# EAGLE design dronemonster (EAGLE 7.7.0)
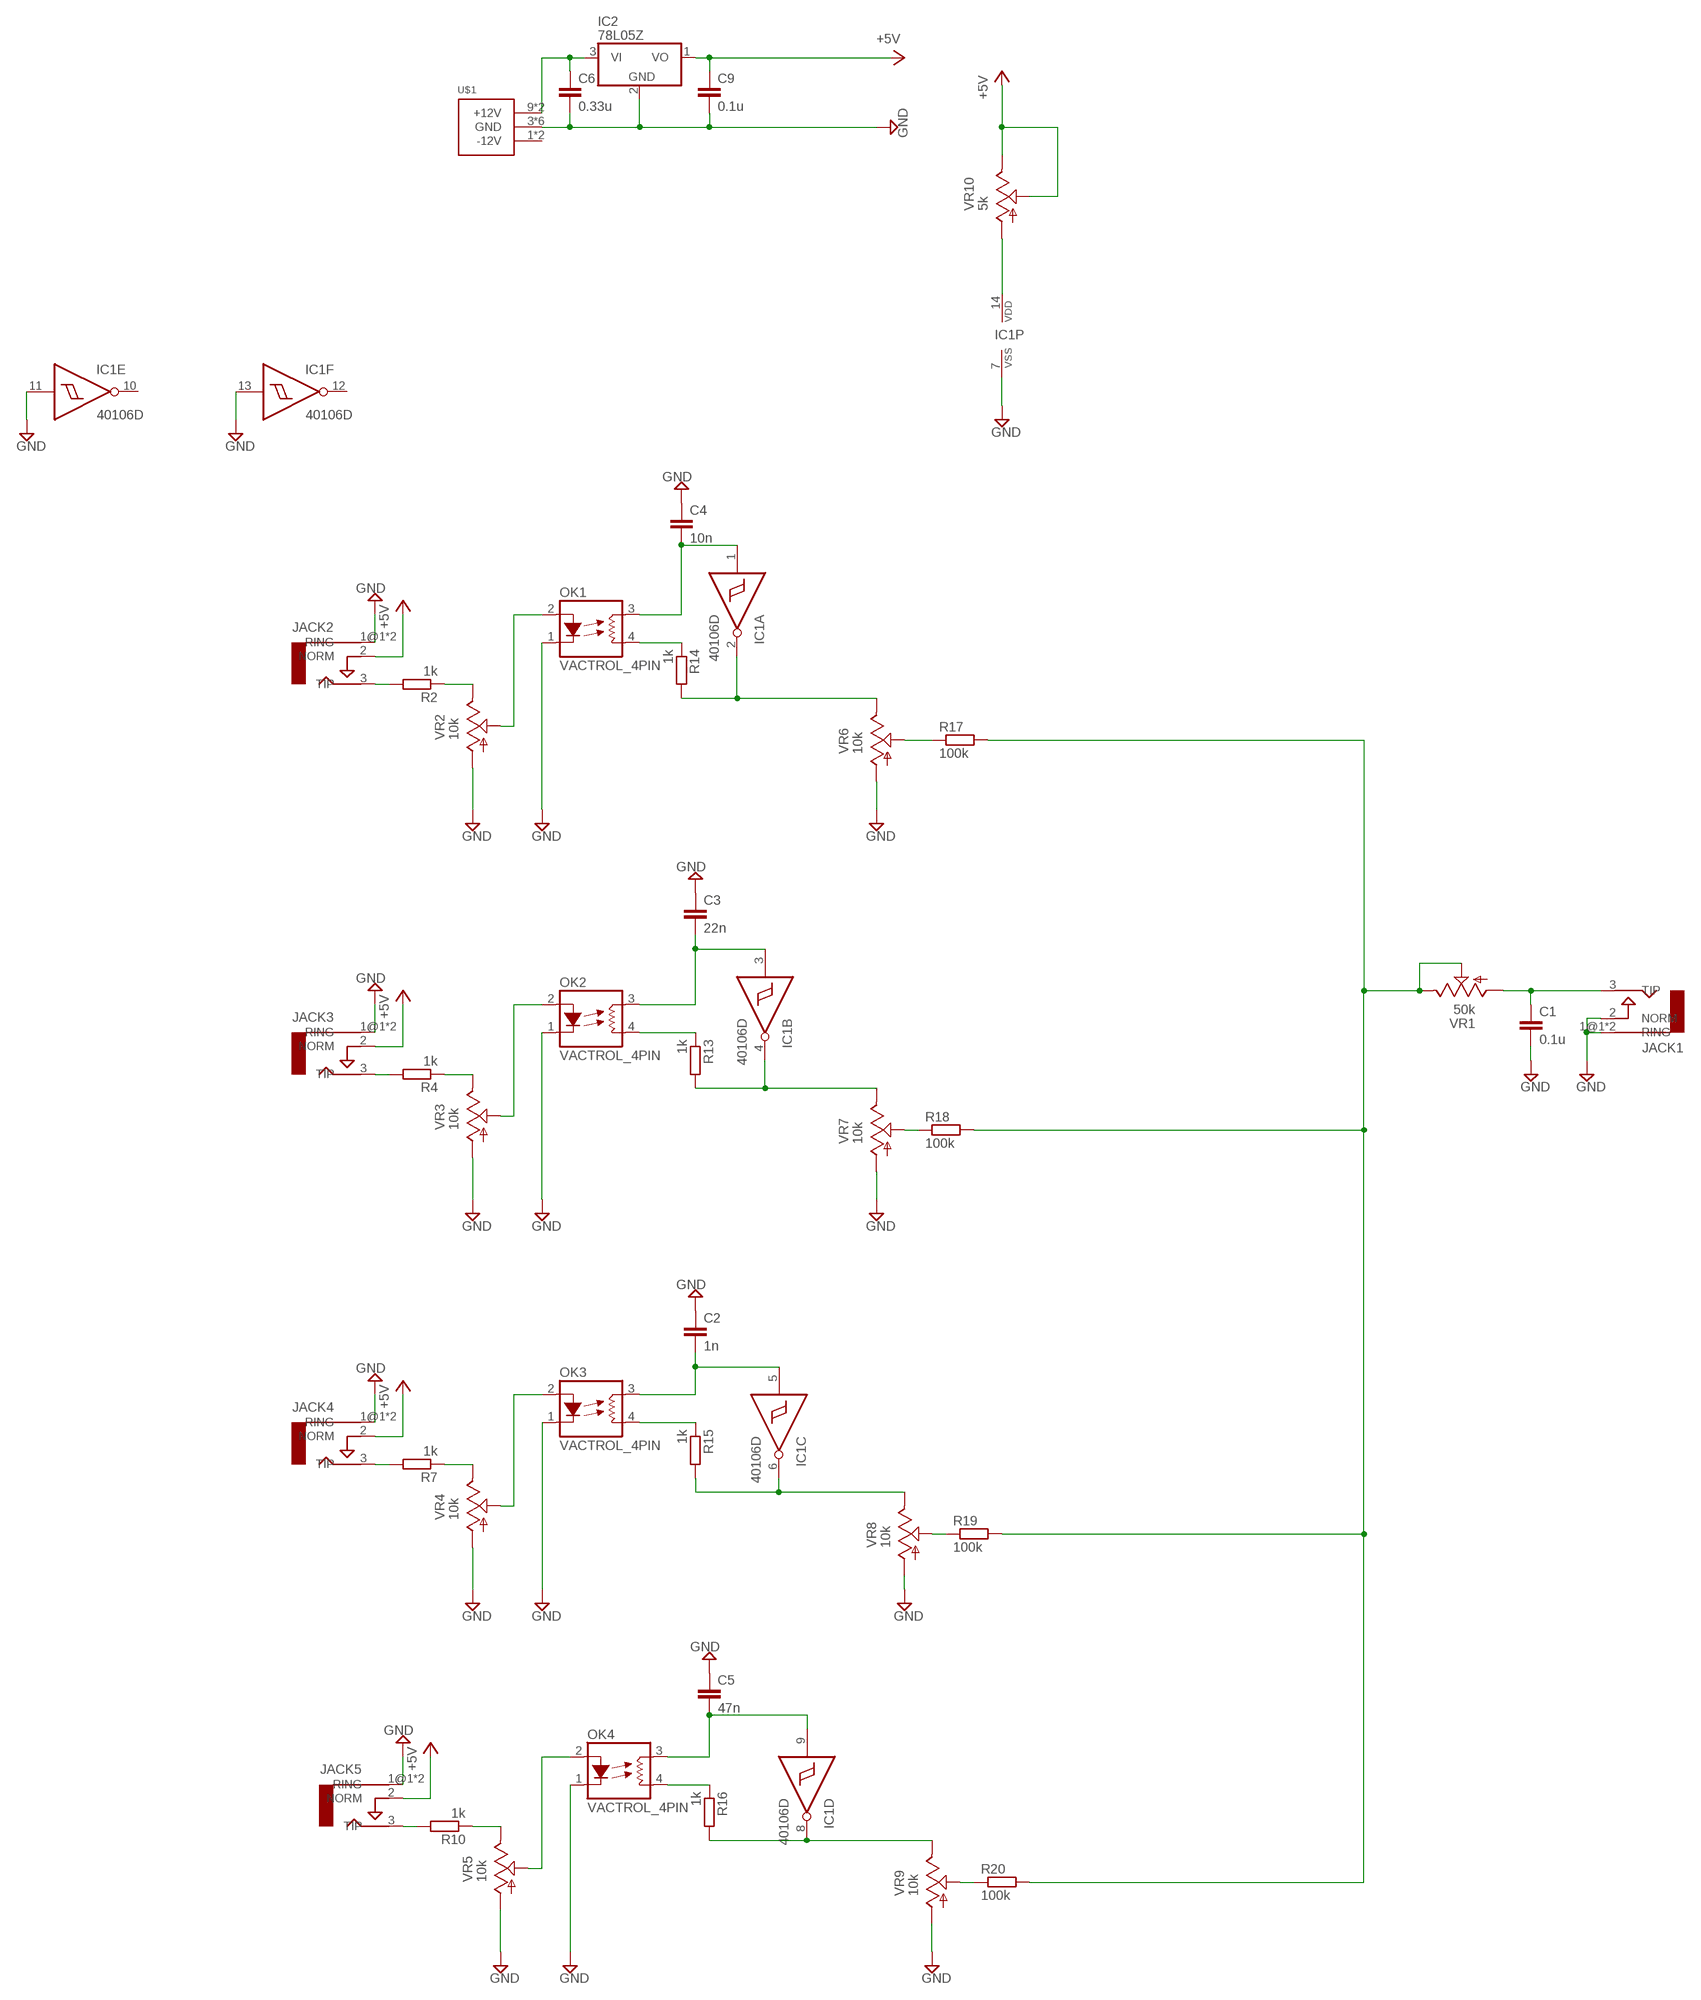
[diagram p0: schematic, sheet 1]

## Parts
C1  0.1u  C-EU050-025X075  [C050-025X075]
C2  1n  C-EU050-025X075  [C050-025X075]
C3  22n  C-EU050-025X075  [C050-025X075]
C4  10n  C-EU050-025X075  [C050-025X075]
C5  47n  C-EU050-025X075  [C050-025X075]
C6  0.33u  C-EUC0805  [C0805]
C9  0.1u  C-EUC0805  [C0805]
IC1  40106D  [SO14]
IC2  78L05Z  [TO92]
JACK1  AUDIO-JACKERTHENVAR  [ERTHENVAR-JACK]
JACK2  AUDIO-JACKERTHENVAR  [ERTHENVAR-JACK]
JACK3  AUDIO-JACKERTHENVAR  [ERTHENVAR-JACK]
JACK4  AUDIO-JACKERTHENVAR  [ERTHENVAR-JACK]
JACK5  AUDIO-JACKERTHENVAR  [ERTHENVAR-JACK]
OK1  VACTROL_4PIN  [VACTROL_4PIN_VTL5C]
OK2  VACTROL_4PIN  [VACTROL_4PIN_VTL5C]
OK3  VACTROL_4PIN  [VACTROL_4PIN_VTL5C]
OK4  VACTROL_4PIN  [VACTROL_4PIN_VTL5C]
R2  1k  R-EU_R0805  [R0805]
R4  1k  R-EU_R0805  [R0805]
R7  1k  R-EU_R0805  [R0805]
R10  1k  R-EU_R0805  [R0805]
R13  1k  R-EU_R0805  [R0805]
R14  1k  R-EU_R0805  [R0805]
R15  1k  R-EU_R0805  [R0805]
R16  1k  R-EU_R0805  [R0805]
R17  100k  R-EU_R0805  [R0805]
R18  100k  R-EU_R0805  [R0805]
R19  100k  R-EU_R0805  [R0805]
R20  100k  R-EU_R0805  [R0805]
U$1  POWER_SIMPLE10  [POWER_10]
VR1  50k  9MM_SNAP-IN_POT_  [9MM_SNAP-IN_POT]
VR2  10k  9MM_SNAP-IN_POT_  [9MM_SNAP-IN_POT]
VR3  10k  9MM_SNAP-IN_POT_  [9MM_SNAP-IN_POT]
VR4  10k  9MM_SNAP-IN_POT_  [9MM_SNAP-IN_POT]
VR5  10k  9MM_SNAP-IN_POT_  [9MM_SNAP-IN_POT]
VR6  10k  9MM_SNAP-IN_POT_  [9MM_SNAP-IN_POT]
VR7  10k  9MM_SNAP-IN_POT_  [9MM_SNAP-IN_POT]
VR8  10k  9MM_SNAP-IN_POT_  [9MM_SNAP-IN_POT]
VR9  10k  9MM_SNAP-IN_POT_  [9MM_SNAP-IN_POT]
VR10  5k  9MM_SNAP-IN_POT_  [9MM_SNAP-IN_POT]

## Nets
+5V: C9.1 IC2.1(VO) JACK2.2(NORM) JACK3.2(NORM) JACK4.2(NORM) JACK5.2(NORM) VR10.2(S) VR10.3(E)
GND: C1.2 C2.1 C3.1 C4.1 C5.1 C6.2 C9.2 IC1.7(P:VSS) IC1.11(E:I) IC1.13(F:I) IC2.2(GND) JACK1.1@1(RING) JACK1.1@2(RING) JACK1.2(NORM) JACK2.1@1(RING) JACK2.1@2(RING) JACK3.1@1(RING) JACK3.1@2(RING) JACK4.1@1(RING) JACK4.1@2(RING) JACK5.1@1(RING) JACK5.1@2(RING) OK1.1(LED-) OK2.1(LED-) OK3.1(LED-) OK4.1(LED-) U$1.3(GND) U$1.4(GND) U$1.5(GND) U$1.6(GND) U$1.7(GND) U$1.8(GND) VR2.1(A) VR3.1(A) VR4.1(A) VR5.1(A) VR6.1(A) VR7.1(A) VR8.1(A) VR9.1(A)
N$1: C1.1 JACK1.3(TIP) VR1.1(A)
N$2: IC1.14(P:VDD) VR10.1(A)
N$3: JACK2.3(TIP) R2.2
N$4: OK1.2(LED+) VR2.2(S)
N$6: R2.1 VR2.3(E)
N$10: R4.1 VR3.3(E)
N$12: JACK3.3(TIP) R4.2
N$14: OK2.2(LED+) VR3.2(S)
N$16: R7.1 VR4.3(E)
N$18: JACK4.3(TIP) R7.2
N$20: OK3.2(LED+) VR4.2(S)
N$22: R10.1 VR5.3(E)
N$24: JACK5.3(TIP) R10.2
N$26: OK4.2(LED+) VR5.2(S)
N$27: R20.1 VR9.2(S)
N$28: R19.1 VR8.2(S)
N$29: OK4.4(RES2) R16.1
N$30: IC1.8(D:O) R16.2 VR9.3(E)
N$31: C5.2 IC1.9(D:I) OK4.3(RES1)
N$32: OK3.4(RES2) R15.1
N$33: IC1.6(C:O) R15.2 VR8.3(E)
N$34: C2.2 IC1.5(C:I) OK3.3(RES1)
N$35: OK2.4(RES2) R13.1
N$36: IC1.4(B:O) R13.2 VR7.3(E)
N$37: C3.2 IC1.3(B:I) OK2.3(RES1)
N$38: OK1.4(RES2) R14.1
N$39: IC1.2(A:O) R14.2 VR6.3(E)
N$40: C4.2 IC1.1(A:I) OK1.3(RES1)
N$41: R18.1 VR7.2(S)
N$45: C6.1 IC2.3(VI) U$1.9(+12V) U$1.10(+12V)
N$46: R17.1 VR6.2(S)
OSC4: R17.2 R18.2 R19.2 R20.2 VR1.2(S) VR1.3(E)
Unconnected: IC1.10(E:O) IC1.12(F:O) U$1.1(-12V) U$1.2(-12V)

## Library data of the parts
C1-C6 C9 = rcl:C-EU: CAPACITOR, European symbol
IC1 = 40xx:40106: Hex SCHMITT TRIGGER
IC2 = linear:78*: Positive VOLTAGE REGULATOR Source: http://cache.national.com/ds/LM/LM78L05.pdf http://www.fairchildsemi.com/ds/LM/LM7805.pdf
JACK1-JACK5 = erthenvar:AUDIO-JACK: Switching Mono 3.5mm Audio Jack from Erthenvar.
OK1-OK4 = MusicThingModular:VACTROL_4PIN: 4 Pin Vactrol Resistive Photocoupler
R2 R4 R7 R10 R13-R20 = rcl:R-EU_: RESISTOR, European symbol
U$1 = eurorack:POWER_SIMPLE
VR1-VR10 = MusicThingModular:9MM_SNAP-IN_POT: 9mm vertical snap-in pot, Alpha / Panasonic style

## Board
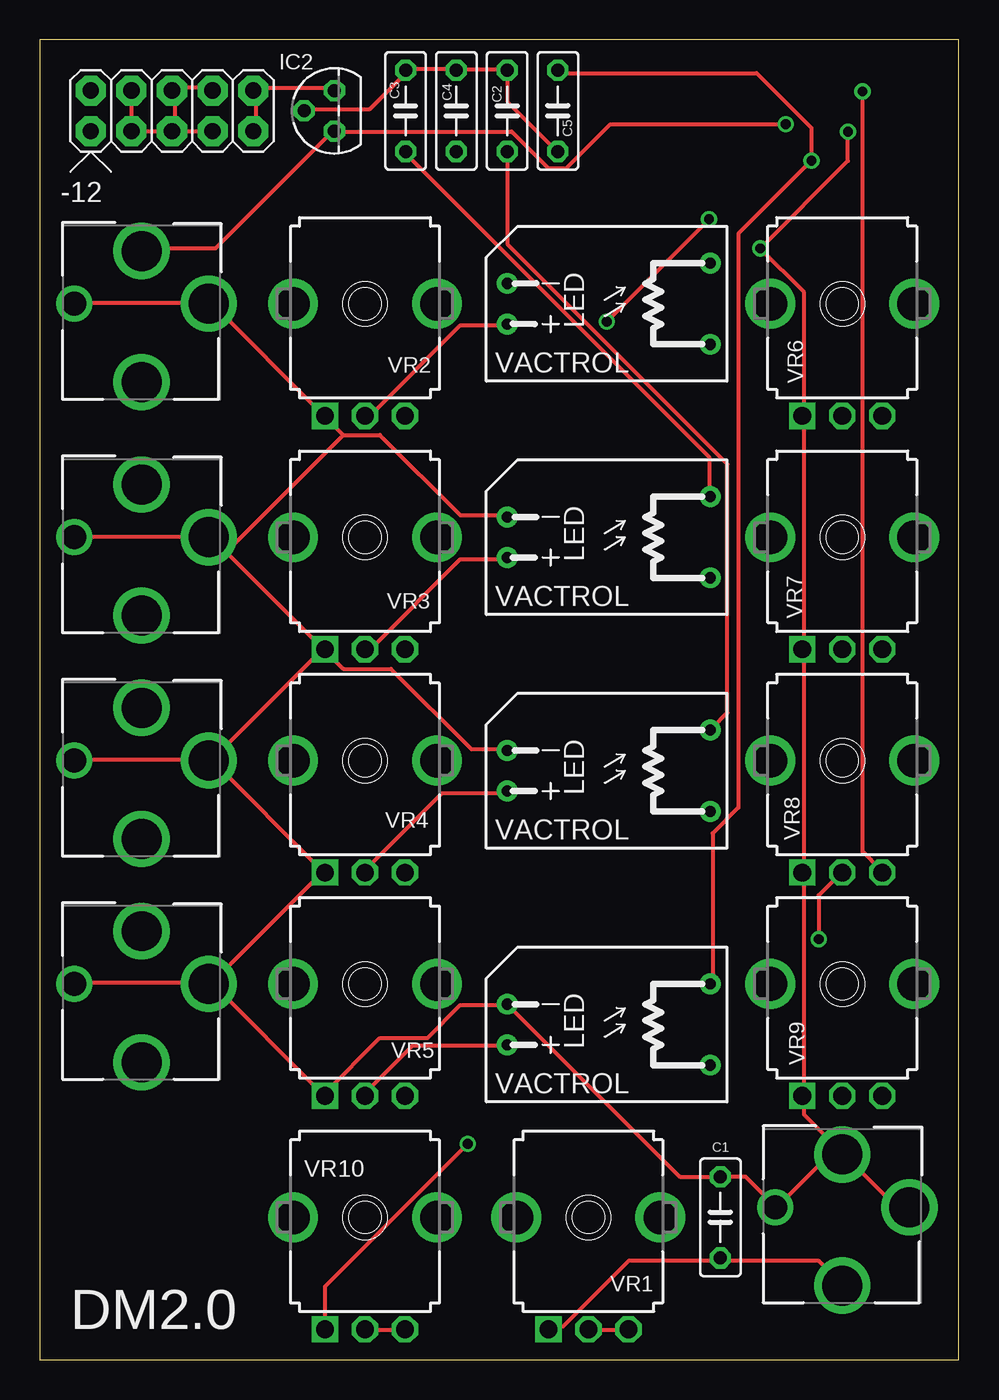
[diagram p1: board, top side]
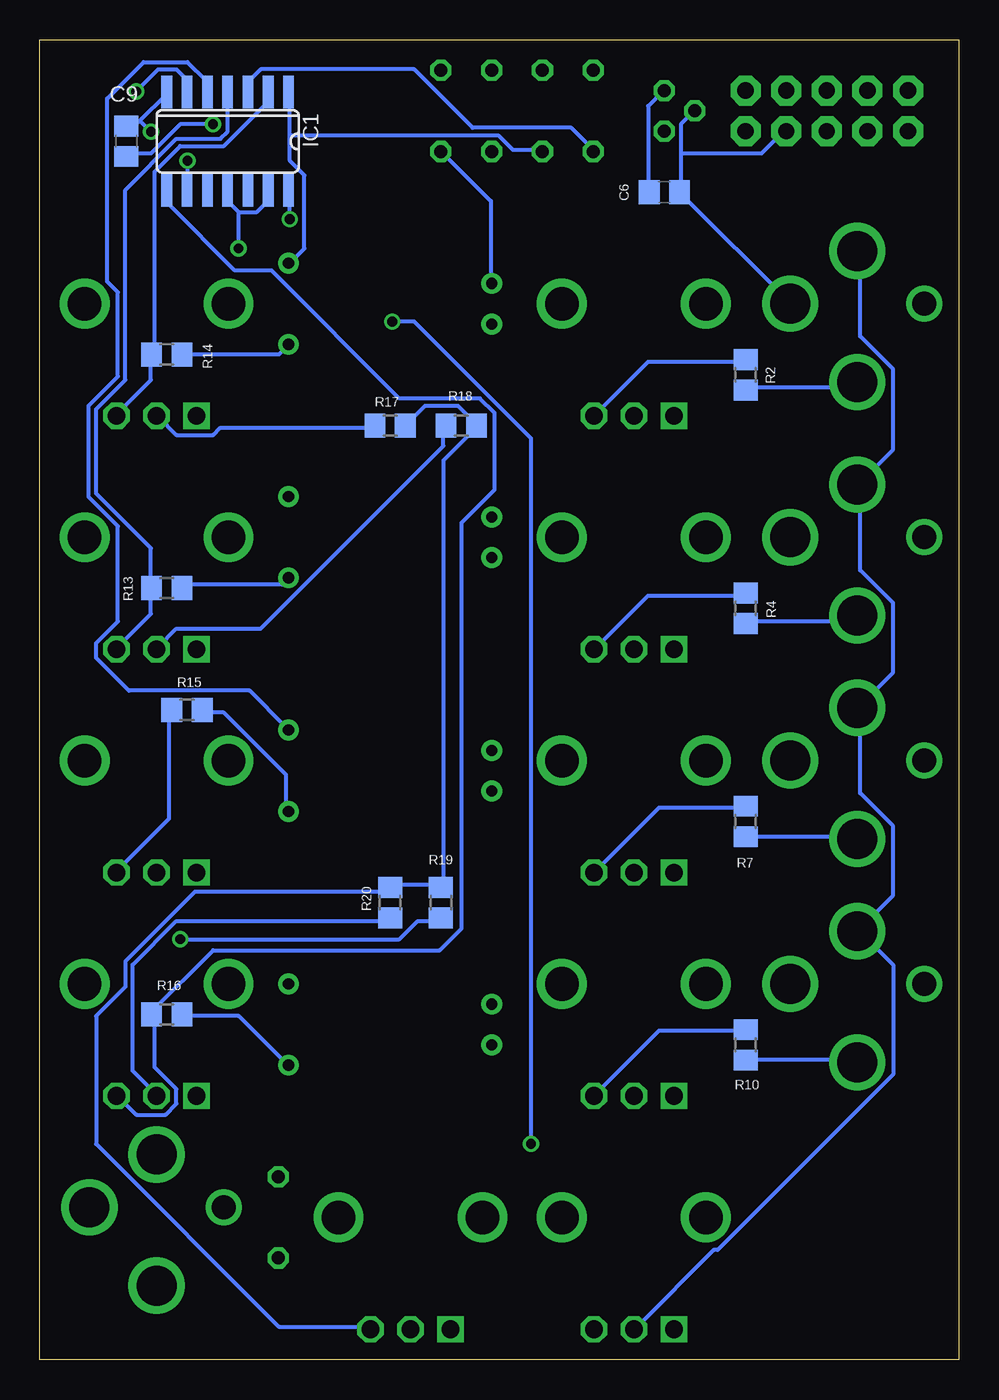
[diagram p2: board, bottom side, seen from below]

Size 57.45 x 82.54 mm. Coordinates in mm from the lower left corner, seen from the top.
Outline: 0,0 57.45,0 57.45,82.54 0,82.54 0,0
Copper layers (1*16): Top 0.035mm / dielectric 1.5mm / Bottom 0.035mm
Design rules "default": minimum track width 10mil, minimum drill 24mil, track to track 8mil, track to pad 8mil, pad to pad 8mil, via to via 8mil, smd to smd 8mil, copper to edge 40mil, drill to drill 8mil, minimum pad ring 10mil, minimum via ring 8mil, stop-mask expansion 4mil, vias tented up to drill 0mil, thermal gap 10mil

### Footprints (pad centres in the part's own frame; a part is rotated, then mirrored left to right if it is on the bottom)
C050-025X075 = drill 0.813 octagon: 1 -2.54,0; 2 2.54,0
C0805 = smd 1.3 x 1.5: 1 -0.95,0; 2 0.95,0
SO14 = smd 0.66 x 2.032: 1 -3.81,-3.073; 2 -2.54,-3.073; 3 -1.27,-3.073; 4 0,-3.073; 5 1.27,-3.073; 6 2.54,-3.073; 7 3.81,-3.073; 8 3.81,3.073; 9 2.54,3.073; 10 1.27,3.073; 11 0,3.073; 12 -1.27,3.073; 13 -2.54,3.073; 14 -3.81,3.073
TO92 = drill 0.813 octagon: 1 -1.27,0; 2 0,1.905; 3 1.27,0
ERTHENVAR-JACK = drill 2.5: 1@1 -4.2,0; 2 0,-3.3; 3 0,4.9 | drill 1.5: 1@2 4.2,0
VACTROL_4PIN_VTL5C = drill 0.7 pad 1.3: 1 -6.35,1.27; 2 -6.35,-1.27; 3 6.35,2.54; 4 6.35,-2.54
R0805 = smd 1.3 x 1.5: 1 -0.95,0; 2 0.95,0
POWER_10 = drill 1.016 pad 1.88 octagon: 1 -5.08,-1.27; 2 -5.08,1.27; 3 -2.54,-1.27; 4 -2.54,1.27; 5 0,-1.27; 6 0,1.27; 7 2.54,-1.27; 8 2.54,1.27; 9 5.08,-1.27; 10 5.08,1.27
9MM_SNAP-IN_POT = drill 1.1 square: 1 -2.5,-7 | drill 1.1 octagon: 2 0,-7; 3 2.5,-7 | drill 2.1 pad 2.794: CHASSIS1 -4.5,0; CHASSIS2 4.5,0

### Placement (x,y rotation side)
C1  42.55,8.89 90 top
C2  29.21,78.11 270 top
C3  22.86,78.11 270 top
C4  26.04,78.11 270 top
C5  32.38,78.11 90 top
C6  18.41,73.03 0 bottom
C9  52.07,76.2 90 bottom
IC1  45.72,76.2 180 bottom
IC2  18.41,78.11 90 top
JACK1  50.16,9.53 180 top
JACK2  6.35,66.04 180 top
JACK3  6.35,51.44 180 top
JACK4  6.35,37.47 180 top
JACK5  6.35,23.5 180 top
OK1  35.56,66.04 0 top
OK2  35.56,51.44 0 top
OK3  35.56,36.83 0 top
OK4  35.56,20.95 0 top
R2  13.34,61.59 270 bottom
R4  13.34,46.99 270 bottom
R7  13.34,33.66 270 bottom
R10  13.34,19.68 270 bottom
R13  49.53,48.26 180 bottom
R14  49.53,62.87 180 bottom
R15  48.26,40.64 180 bottom
R16  49.53,21.59 180 bottom
R17  35.56,58.42 0 bottom
R18  31.11,58.42 0 bottom
R19  32.38,28.57 90 bottom
R20  35.56,28.57 90 bottom
U$1  8.26,78.11 0 top
VR1  34.29,8.89 0 top
VR2  20.32,66.04 0 top
VR3  20.32,51.44 0 top
VR4  20.32,37.47 0 top
VR5  20.32,23.5 0 top
VR6  50.16,66.04 0 top
VR7  50.16,51.44 0 top
VR8  50.16,37.47 0 top
VR9  50.16,23.5 0 top
VR10  20.32,8.89 0 top

### Tracks (layer width: path | path; a pad name or v marks a point on that pad's centre or on a via)
+5V  (via drill 0.61)
  Top 0.254: v46.63,77.27 35.66,77.27 32.92,74.52 31.77,74.52 29.49,76.81 18.52,76.81 IC2.1 18.29,76.81 10.97,69.49 6.4,69.49 JACK2.2 | VR10.2 20.34,1.83 22.63,1.83 VR10.3
  Bottom 0.254: v46.63,77.27 48.69,77.27 50.52,75.44 51.89,75.44 C9.1 | VR10.2 20.12,2.06 15.32,6.86 15.09,6.86 4.12,17.83 4.12,24.69 6.17,26.75 JACK5.2 6.17,26.98 4.12,29.03 4.12,33.38 6.17,35.43 6.17,40.69 JACK4.2 6.17,40.92 4.12,42.98 4.12,47.32 6.17,49.38 6.17,54.63 JACK3.2 6.17,54.86 4.12,56.92 4.12,61.95 6.17,64.01 6.17,69.27 JACK2.2
GND  (via drill 0.61)
  Top 0.254: v50.52,76.81 50.52,74.98 v45.03,69.49 47.78,66.75 47.78,59.21 VR6.1 47.78,58.98 47.78,44.58 VR7.1 47.78,44.35 47.78,30.63 VR8.1 47.78,30.4 47.78,16.69 VR9.1 47.78,16.46 47.78,15.32 49.84,13.26 | 49.84,13.26 50.06,13.03 JACK1.2 | 49.84,13.26 46.18,9.6 JACK1.1@2 45.95,9.6 44.12,11.43 C1.2 40.01,11.43 OK4.1 29.03,22.17 26.29,22.17 24.23,20.12 21.26,20.12 17.83,16.69 VR5.1 17.6,16.69 10.74,23.55 | 49.84,13.26 JACK1.2 | JACK1.1@1 54.18,9.6 53.49,9.6 50.29,12.8 JACK1.2 | U$1.8 10.74,79.55 8.46,79.55 U$1.6 8.46,79.32 8.46,77.04 U$1.5 | U$1.4 U$1.3 5.71,76.81 8.23,76.81 U$1.5 | U$1.5 8.46,76.81 10.74,76.81 U$1.7 | C5.1 32.23,75.67 29.26,78.64 29.26,80.47 C2.1 29.03,80.7 26.06,80.7 C4.1 25.83,80.7 22.86,80.7 C3.1 22.86,80.47 20.57,78.18 16.69,78.18 IC2.2 | 18.97,57.84 21.26,57.84 26.29,52.81 29.03,52.81 OK2.1 | 18.97,57.84 17.83,58.98 VR2.1 17.6,59.21 10.74,66.06 JACK2.1@1 10.52,66.06 2.29,66.06 JACK2.1@2 | 10.74,23.55 17.6,30.4 VR4.1 17.6,30.63 10.74,37.49 | JACK5.1@2 2.29,23.55 10.52,23.55 JACK5.1@1 10.74,23.55 | JACK4.1@2 2.29,37.49 10.52,37.49 JACK4.1@1 10.74,37.49 | OK3.1 29.03,38.18 26.98,38.18 21.95,43.2 18.97,43.2 17.83,44.35 VR3.1 | JACK3.1@1 JACK3.1@2 | 11.66,50.52 10.74,51.44 JACK3.1@1 | 11.66,50.52 17.6,44.58 VR3.1 | 10.74,37.49 17.6,44.35 VR3.1 | 11.66,50.52 18.97,57.84 | 11.66,50.52 JACK3.1@1
  Bottom 0.254: 51.21,77.5 49.61,79.1 IC1.7 | 51.21,77.5 51.44,77.27 51.89,77.27 C9.2 | 45.03,71.78 43.89,71.78 43.2,72.47 43.2,72.92 IC1.13 | 45.03,71.78 45.72,72.47 IC1.11 | v45.03,69.49 45.03,71.78 | v50.52,76.81 51.21,77.5 | 17.37,75.44 17.37,77.27 16.69,77.95 IC2.2 | 17.37,75.44 17.37,73.15 C6.2 17.37,72.92 10.52,66.06 JACK2.1@1 | 17.37,75.44 12.34,75.44 10.97,76.81 U$1.7 | OK1.1 29.26,67.44 29.26,72.47 32.23,75.44 C5.1
N$1
  Top 0.254: JACK1.3 50.06,4.8 48.69,6.17 42.75,6.17 C1.1 42.52,6.17 36.8,6.17 32.69,2.06 32,2.06 VR1.1
N$2  (via drill 0.61)
  Top 0.254: v35.43,64.92 v41.83,71.32 | v26.75,13.49 17.83,4.57 17.83,2.06 VR10.1
  Bottom 0.254: v41.83,71.32 41.83,72.92 IC1.14 | v35.43,64.92 34.06,64.92 26.75,57.61 v26.75,13.49
N$3
  Bottom 0.254: R2.2 13.26,60.81 6.63,60.81 6.4,61.04 JACK2.3
N$4
  Top 0.254: OK1.2 29.03,64.69 26.29,64.69 20.8,59.21 20.34,59.21 VR2.2
N$6
  Bottom 0.254: R2.1 13.49,62.41 19.43,62.41 22.63,59.21 VR2.3
N$10
  Bottom 0.254: R4.1 13.49,47.78 19.43,47.78 22.63,44.58 VR3.3
N$12
  Bottom 0.254: R4.2 13.26,46.18 6.63,46.18 6.4,46.41 JACK3.3
N$14
  Top 0.254: OK2.2 29.03,50.06 26.29,50.06 20.8,44.58 20.34,44.58 VR3.2
N$16
  Bottom 0.254: R7.1 13.49,34.52 18.75,34.52 22.63,30.63 VR4.3
N$18
  Bottom 0.254: R7.2 13.26,32.69 6.4,32.69 JACK4.3
N$20
  Top 0.254: OK3.2 29.03,35.43 25.15,35.43 20.34,30.63 VR4.2
N$22
  Bottom 0.254: R10.1 13.49,20.57 18.75,20.57 22.63,16.69 VR5.3
N$24
  Bottom 0.254: R10.2 13.26,18.75 6.4,18.75 JACK5.3
N$26
  Top 0.254: OK4.2 29.03,19.66 23.32,19.66 20.34,16.69 VR5.2
N$27
  Bottom 0.254: R20.1 35.66,27.43 48.92,27.43 51.66,24.69 51.66,18.06 50.29,16.69 VR9.2
N$28  (via drill 0.61)
  Top 0.254: v48.69,26.29 48.69,29.03 50.06,30.4 VR8.2
  Bottom 0.254: v48.69,26.29 34.98,26.29 33.83,27.43 32.46,27.43 R19.1
N$29
  Bottom 0.254: R16.1 48.46,21.49 45.03,21.49 42.06,18.52 OK4.4
N$30
  Bottom 0.254: VR9.3 52.58,16.46 51.44,15.32 49.61,15.32 48.92,16 48.92,16.92 50.29,18.29 50.29,21.49 R16.2 50.52,21.72 46.63,25.6 32.46,25.6 31.09,26.98 31.09,52.35 29.03,54.41 29.03,59.21 29.95,60.12 34.98,60.12 42.98,68.12 45.26,68.12 49.38,72.24 49.38,72.92 IC1.8
N$31  (via drill 0.61)
  Top 0.254: C5.2 32.46,80.47 44.81,80.47 48.23,77.04 v48.23,74.98 43.66,70.41 43.66,34.52 42.06,32.92 42.06,23.55 OK4.3
  Bottom 0.254: v48.23,74.98 48.23,73.15 IC1.9
N$32
  Bottom 0.254: R15.1 47.09,40.46 45.95,40.46 42.06,36.58 42.06,34.29 OK3.4
N$33  (via drill 0.61)
  Top 0.254: v51.44,79.32 51.44,31.77 52.58,30.63 VR8.3
  Bottom 0.254: R15.2 49.38,40.46 49.38,33.83 52.58,30.63 VR8.3 | v51.44,79.32 50.06,80.7 48.92,80.7 48.46,80.24 48.46,79.32 IC1.6
N$34
  Top 0.254: C2.2 29.26,75.44 29.26,69.72 42.98,56.01 42.98,40.46 42.06,39.55 OK3.3
  Bottom 0.254: IC1.5 47.09,79.32 47.09,80.01 48.23,81.15 50.98,81.15 53.26,78.87 53.26,67.44 52.58,66.75 52.58,61.49 54.41,59.66 54.41,53.95 52.58,52.12 52.58,46.18 53.95,44.81 53.95,43.89 51.89,41.83 44.35,41.83 42.06,39.55 OK3.3
N$35
  Bottom 0.254: R13.1 48.46,48.46 42.29,48.46 42.06,48.69 OK2.4
N$36
  Bottom 0.254: VR7.3 52.58,44.58 50.52,46.63 50.52,48.23 R13.2 50.52,48.46 50.52,50.75 53.95,54.18 53.95,59.44 52.12,61.27 52.12,73.15 48.92,76.35 46.18,76.35 45.72,76.81 IC1.4
N$37
  Top 0.254: OK2.3 41.83,54.18 41.83,56.46 22.86,75.44 C3.2
  Bottom 0.254: IC1.3 44.35,79.32 44.35,80.01 43.66,80.7 34.06,80.7 30.4,77.04 24.23,77.04 22.86,75.67 C3.2
N$38
  Bottom 0.254: R14.1 42.52,62.87 42.06,63.32 OK1.4
N$39
  Bottom 0.254: VR6.3 52.58,59.21 50.52,61.27 50.52,62.87 R14.2 50.29,62.87 50.29,74.3 48.69,75.89 45.95,75.89 43.2,78.64 43.2,79.1 IC1.2
N$40
  Bottom 0.254: 41.83,76.58 41.83,74.98 40.92,74.07 40.92,69.49 41.83,68.58 OK1.3 | 41.83,76.58 41.83,79.1 IC1.1 | 41.83,76.58 28.8,76.58 27.89,75.67 26.06,75.67 C4.2
N$41
  Bottom 0.254: R18.1 32.23,58.29 32.23,57.15 43.66,45.72 48.92,45.72 50.06,44.58 VR7.2
N$45
  Top 0.254: U$1.9 13.49,77.04 13.49,79.32 U$1.10 13.49,79.55 18.29,79.55 IC2.3
  Bottom 0.254: C6.1 19.43,73.15 19.43,78.41 18.52,79.32 IC2.3
N$46
  Bottom 0.254: R17.1 36.58,58.29 46.18,58.29 46.63,57.84 48.92,57.84 50.06,58.98 VR6.2
OSC4
  Top 0.254: VR1.2 34.29,1.83 36.58,1.83 VR1.3
  Bottom 0.254: R17.2 34.52,58.52 33.38,59.66 31.32,59.66 30.18,58.52 R18.2 30.18,58.29 32.23,56.24 32.23,29.72 R19.2 32.46,29.72 35.43,29.72 R20.2 35.66,29.49 35.89,29.26 47.78,29.26 52.12,24.92 52.12,23.32 53.95,21.49 53.95,13.49 42.52,2.06 36.8,2.06 VR1.3

### Text on the board
tNames: DM2.0